# Altium project MotorControlPower.PrjPCB
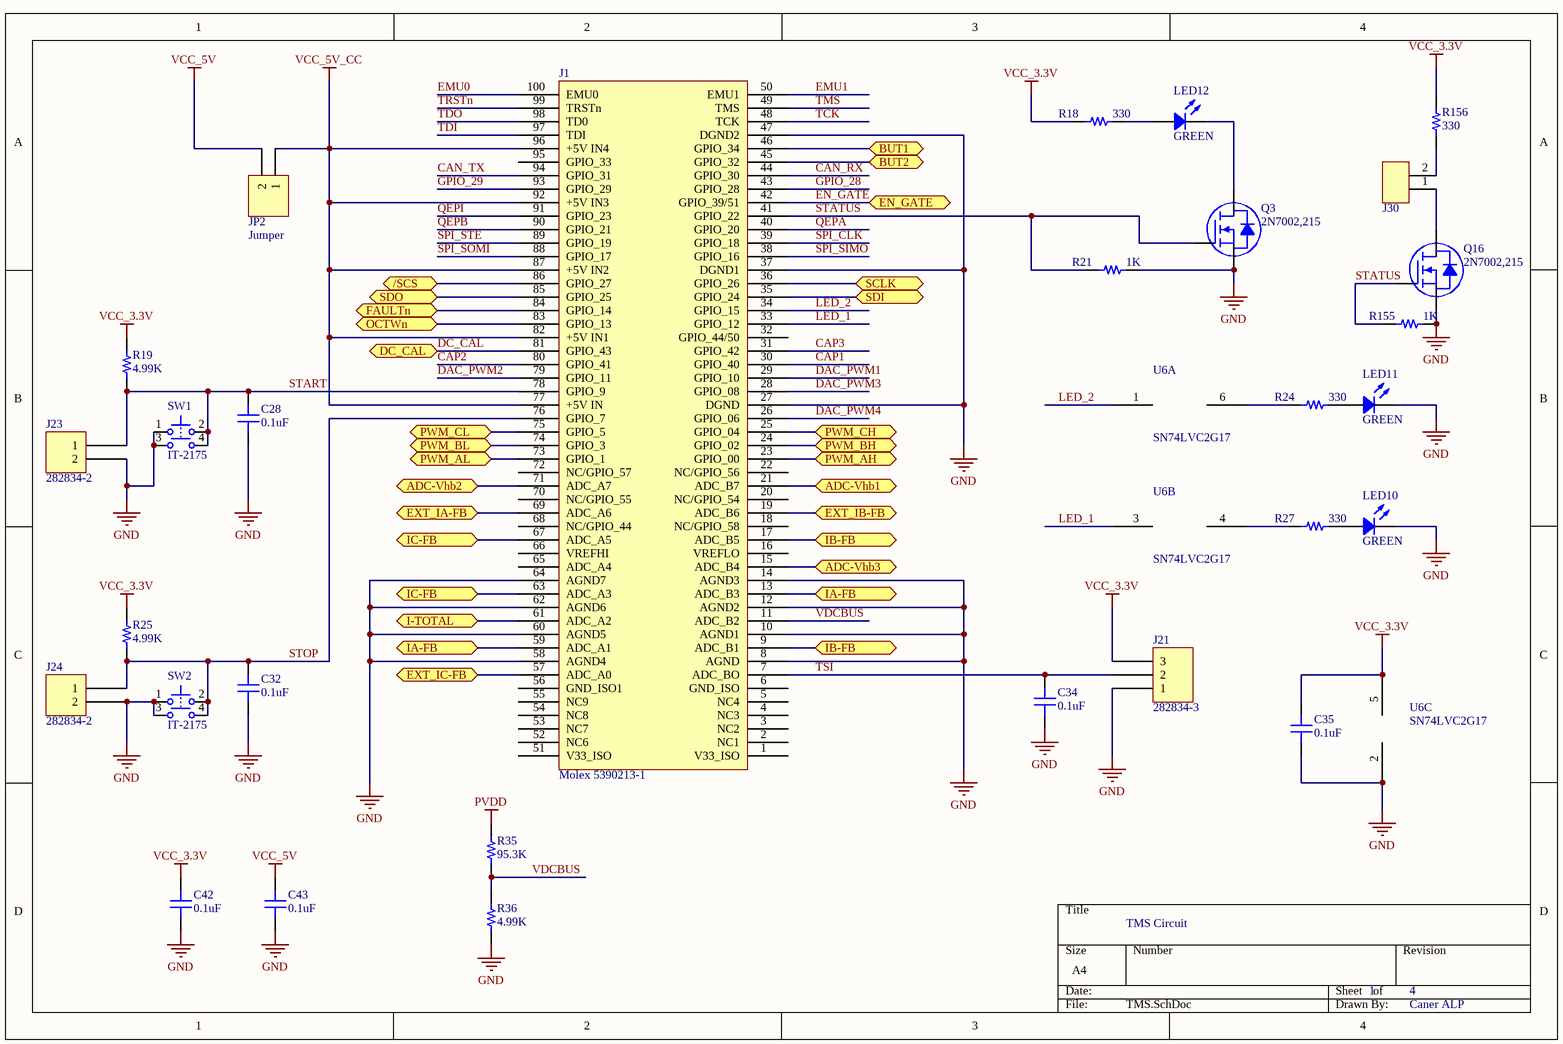
[diagram p0: TMS.SchDoc]
4 sheets, 225 parts. Net scope: flat (ports and power ports of the same name join across sheets).
Board file: Motor.PcbDoc
Sheets:
  TMS.SchDoc
  DRV8301.SchDoc
  Motor_Power.SchDoc
  Motor_PowerMosfet.SchDoc

## Sheet TMS.SchDoc: TMS Circuit
size A4; Date: 11.05.2017; DrawnBy: Caner ALP; Organization: Eastern Mediterranean University; DocumentNumber: 1; SheetNumber: 1; SheetTotal: 4; DocumentName: TMS Circuit; ProjectName: Tubitak Electric Vehicle Motor Control Board

### Parts
C28  0.1uF  [CAP 0603/1608]
C32  0.1uF  [CAP 0603/1608]
C34  0.1uF  [CAP 0603/1608]
C35  0.1uF  [CAP 0603/1608]
C42  0.1uF  [CAP 0603/1608]
C43  0.1uF  [CAP 0603/1608]
J1  Molex 5390213-1  [DIMM100]
J21  282834-3  [TE 282834-3]
J23  282834-2  [TE 282834-2]
J24  282834-2  [TE 282834-2]
J30  HDR_1x2  [PINHEAD_2.54mm_1x2]  (value not drawn)
JP2  Jumper  [Header 2.54mm - duplicate]
LED10  GREEN  [LED 0805/2012 YELLOW]
LED11  GREEN  [LED 0805/2012 YELLOW]
LED12  GREEN  [LED 0805/2012 YELLOW]
Q3  2N7002,215  [NXP SOT-23-3 TO-236AB]
Q16  2N7002,215  [NXP SOT-23-3 TO-236AB]
R18  330  [RES 0603/1608]
R19  4.99K  [RES 0603/1608]
R21  1K  [RES 0603/1608]
R24  330  [RES 0603/1608]
R25  4.99K  [RES 0603/1608]
R27  330  [RES 0603/1608]
R35  95.3K  [RES 0603/1608]
R36  4.99K  [RES 0603/1608]
R155  1K  [RES 0603/1608]
R156  330  [RES 0603/1608]
SW1  IT-2175  [Tick Tole Switch]
SW2  IT-2175  [Tick Tole Switch]
U6  SN74LVC2G17  [DBV006]  (parts A,B,C of 3)

### Ports
/SCS, ADC-Vhb1, ADC-Vhb2, ADC-Vhb3, BUT1, BUT2, DC_CAL, EN_GATE, EXT_IA-FB, EXT_IB-FB, EXT_IC-FB, FAULTn, I-TOTAL, IA-FB, IB-FB, IC-FB, OCTWn, PWM_AH, PWM_AL, PWM_BH, PWM_BL, PWM_CH, PWM_CL, SCLK, SDI, SDO

### Nets
GND: C28.1 C32.1 C34.1 C35.1 C42.1 C43.1 J1.8(AGND) J1.10(AGND1) J1.12(AGND2) J1.14(AGND3) J1.27(DGND) J1.37(DGND1) J1.47(DGND2) J1.58(AGND4) J1.60(AGND5) J1.62(AGND6) J1.64(AGND7) J21.1 J23.2 J24.2 LED10.2 LED11.2 Q3.3(S) Q16.3(S) R21.2 R36.2 R155.2 SW1.1 SW1.3 SW2.1 SW2.3 U6.2(EMU2)
PVDD: R35.1
VCC_3.3V: C35.2 C42.2 J21.3 R18.1 R19.2 R25.2 R156.2 U6.5(EMU1)
VCC_5V: C43.2 JP2.2
VCC_5V_CC: J1.77(+5V_IN) J1.82(+5V_IN1) J1.87(+5V_IN2) J1.92(+5V_IN3) J1.96(+5V_IN4) JP2.1
/SCS: J1.86(GPIO_27) ; port /SCS
CAN_RX: J1.44(GPIO_30)
CAN_TX: J1.94(GPIO_31)
CAP1: J1.30(GPIO_40)
CAP2: J1.80(GPIO_41)
CAP3: J1.31(GPIO_42)
DAC_PWM1: J1.29(GPIO_10)
DAC_PWM2: J1.79(GPIO_11)
DAC_PWM3: J1.28(GPIO_08)
DAC_PWM4: J1.26(GPIO_06)
DC_CAL: J1.81(GPIO_43) ; port DC_CAL
EMU0: J1.100(EMU0)
EMU1: J1.50(EMU1)
EN_GATE: J1.42(GPIO_39/51) ; port EN_GATE
FAULTn: J1.84(GPIO_14) ; port FAULTn
GPIO_28: J1.43(GPIO_28)
GPIO_29: J1.93(GPIO_29)
LED_1: J1.33(GPIO_12) U6.3(EMU1)
LED_2: J1.34(GPIO_15) U6.1(EMU1)
QEPA: J1.40(GPIO_20)
QEPB: J1.90(GPIO_21)
QEPI: J1.91(GPIO_23)
SCLK: J1.36(GPIO_26) ; port SCLK
SDI: J1.35(GPIO_24) ; port SDI
SDO: J1.85(GPIO_25) ; port SDO
SPI_CLK: J1.39(GPIO_18)
SPI_SIMO: J1.38(GPIO_16)
SPI_SOMI: J1.88(GPIO_17)
SPI_STE: J1.89(GPIO_19)
START: C28.2 J1.78(GPIO_9) J23.1 R19.1 SW1.2 SW1.4
STATUS: J1.41(GPIO_22) Q3.1(G) Q16.1(G) R21.1 R155.1
STOP: C32.2 J1.76(GPIO_7) J24.1 R25.1 SW2.2 SW2.4
TCK: J1.48(TCK)
TDI: J1.97(TDI)
TDO: J1.98(TD0)
TMS: J1.49(TMS)
TRSTn: J1.99(TRSTn)
TSI: C34.2 J1.7(ADC_BO) J21.2
VDCBUS: J1.11(ADC_B2) R35.2 R36.1
NetC67_2: J1.21(ADC_B7) ; port ADC-Vhb1
NetC68_2: J1.71(ADC_A7) ; port ADC-Vhb2
NetC69_2: J1.15(ADC_B4) ; port ADC-Vhb3
NetC86_2: J1.61(ADC_A2) ; port I-TOTAL
NetC87_2: J1.9(ADC_B1) J1.17(ADC_B5) ; port IB-FB
NetC88_2: J1.13(ADC_B3) J1.59(ADC_A1) ; port IA-FB
NetC95_2: J1.19(ADC_B6) ; port EXT_IB-FB
NetC96_2: J1.69(ADC_A6) ; port EXT_IA-FB
NetC97_2: J1.57(ADC_A0) ; port EXT_IC-FB
NetC150_2: J1.46(GPIO_34) ; port BUT1
NetC151_2: J1.45(GPIO_32) ; port BUT2
NetJ1_23: J1.23(GPIO_00) ; port PWM_AH
NetJ1_24: J1.24(GPIO_02) ; port PWM_BH
NetJ1_25: J1.25(GPIO_04) ; port PWM_CH
NetJ1_63: J1.63(ADC_A3) J1.67(ADC_A5) ; port IC-FB
NetJ1_73: J1.73(GPIO_1) ; port PWM_AL
NetJ1_74: J1.74(GPIO_3) ; port PWM_BL
NetJ1_75: J1.75(GPIO_5) ; port PWM_CL
NetJ1_83: J1.83(GPIO_13) ; port OCTWn
NetJ30_1: J30.1 Q16.2(D)
NetJ30_2: J30.2 R156.1
NetLED10_1: LED10.1 R27.2
NetLED11_1: LED11.1 R24.2
NetLED12_1: LED12.1 R18.2
NetLED12_2: LED12.2 Q3.2(D)
NetR24_1: R24.1 U6.6(EMU2)
NetR27_1: R27.1 U6.4(EMU2)

Not connected (* = marked no-connect by the designer): J1 1(V33_ISO) 2(NC1) 3(NC2) 4(NC3) 5(NC4) 6(GND_ISO) 16(VREFLO) 18(NC/GPIO_58) 20(NC/GPIO_54) 22(NC/GPIO_56) 32(GPIO_44/50) 51(V33_ISO) 52(NC6) 53(NC7) 54(NC8) 55(NC9) 56(GND_ISO1) 65(ADC_A4) 66(VREFHI) 68(NC/GPIO_44) 70(NC/GPIO_55) 72(NC/GPIO_57) 95(GPIO_33)

### Library data of the parts
C28 C32 C34 C35 C42 C43 = CC0603KPX7R7BB104: CAP CER 0.1UF 16V X7R 0603; Manufacturer: Yageo; TemperatureRange: -55C ~ 125C; Tolerance: 10%; Value: 0.1uF; Part Number: CC0603KPX7R7BB104; PartId: 5262; Supplier 1: Digi-Key; Supplier Part Number 1: 311-1335-2-ND; ComponentLink1Description: Datasheet; ComponentLink1URL: http://www.yageo.com/documents/recent/UPY-GPHC_X7R_6.3V-to-50V-v12.pdf; ComponentLink2Description: Digi-Key listing; ComponentLink2URL: http://digikey.com/product-detail/en/CC0603KPX7R7BB104/311-1335-2-ND/2103073; TemperatureCoefficient: X7R; Voltage: 16V; Price: 0,0043; Type: -; Device Package: 0603 (1608 Metric)
J1 = DIMM100 DRAM: DIMM Connectors DIMM SKT 100P 2.54mm
J21 = 282834-3: TERM BLOCK 3POS SIDE ENT 2.54MM; Manufacturer: TE Connectivity AMP Connectors; TemperatureRange: -40C ~ 105C; Voltage: 150V; Pitch: 0.100" (2.54mm); Number Of Levels: 1; Positions Per Level: 3; Part Number: 282834-3; PartId: 9290; Supplier 1: Digi-Key; Supplier Part Number 1: A98334-ND; ComponentLink1Description: Datasheet; ComponentLink1URL: http://www.te.com/commerce/DocumentDelivery/DDEController?Action=srchrtrv&DocNm=282834&DocType=Customer+Drawing&DocLang=English; ComponentLink2Description: Digi-Key Listing; ComponentLink2URL: http://www.digikey.ca/product-detail/en/282834-3/A98334-ND/1153264; Price: 2,25; Colour: Green; Orientation: Horizontal with Board
J23 J24 = 282834-2: TERM BLOCK 2POS SIDE ENT 2.54MM; Manufacturer: TE Connectivity AMP Connectors; TemperatureRange: -40C ~ 105C; Voltage: 150V; Pitch: 0.100" (2.54mm); Number Of Levels: 1; Positions Per Level: 2; Part Number: 282834-2; PartId: 9289; Supplier 1: Digi-Key; Supplier Part Number 1: A98333-ND; ComponentLink1Description: Datasheet; ComponentLink1URL: http://www.te.com/commerce/DocumentDelivery/DDEController?Action=srchrtrv&DocNm=282834&DocType=Customer+Drawing&DocLang=English; ComponentLink2Description: Digi-Key Listing; ComponentLink2URL: http://www.digikey.ca/product-detail/en/282834-2/A98333-ND/1150135; Price: 1,3; Colour: Green; Orientation: Horizontal with Board
J30 = J00093: CONN HEADER 2POS .100 VERT TIN; Part Number: J00093; Manufacturer: Molex, LLC; Manufacturer Part Number: 22284020; Connector Type: Header, Unshrouded, Breakaway; Pitch: 2.54mm; Number of Positions: 2; Current Rating: 4A; Voltage - Rated: 250V; Series: KK® 42375; Supplier 1: Digi-Key; Contact Type: Male Pin; Mounting Type: Through Hole; Supplier Part Number 1: WM50014-02-ND; HelpURL: http://www.molex.com/pdm_docs/sd/022284020_sd.pdf; Operating Temperature: -40°C ~ 105°C; Contact Finish: Tin; Housing Color: Black; Number of Rows: 1
JP2 = Header 2: Header, 2-Pin; LatestRevisionDate: 17-Jul-2002; LatestRevisionNote: Re-released for DXP Platform.; Publisher: Altium Limited
LED10-LED12 = LTST-C170KFKT: LED ORANGE CLEAR 0805 SMD; Manufacturer: Lite-On Inc.; Type: Surface Mount; Millicandela: 90mcd; Voltage Forward: 2V; Current (Test): 20mA; Viewing Angle: 130; Value: Green; Part Number: LTST-C170KFKT; PartId: 7079; Supplier 1: Digi-Key; Supplier Part Number 1: 160-1413-2-ND; ComponentLink1Description: Datasheet; ComponentLink1URL: http://optoelectronics.liteon.com/upload/download/DS-22-99-0185/S_110_LTST-C170KFKT.pdf; ComponentLink2Description: Digi-Key Listing; ComponentLink2URL: http://www.digikey.ca/product-detail/en/LTST-C170KFKT/160-1413-2-ND/386775; Price: 0,0638; Device Package: 0805 (2012 Metric); Colour: Orange; Lens Transparency: Clear
Q3 Q16 = 2N7002,215: MOSFET N-CH 60V 300MA SOT-23; Manufacturer: NXP Semiconductors; Type: MOSFET N-Channel, Metal Oxide; Rds On (Max) at Id, Vgs: 5 Ohm @ 500mA, 10V; Vgs(th) (Max) at Id: 2.5V @ 250uA; Input Capacitance (Ciss) at Vds: 50pF @ 10V; Power - Max: 830mW; Current Continuous Drain: 300mA (Ta); Part Number: 2N7002,215; PartId: 7965; Supplier 1: Digi-Key; Supplier Part Number 1: 568-1369-2-ND; ComponentLink1Description: Datasheet; ComponentLink1URL: http://www.nxp.com/documents/data_sheet/2N7002.pdf; ComponentLink2Description: Digi-Key Listing; ComponentLink2URL: http://www.digikey.com/product-detail/en/2N7002,215/568-1369-2-ND/762973; Price: 0,0368; Device Package: TO-236-3, SC-59, SOT-23-3; Gate Charge (Qg): -; Drain to Source Voltage (Vdss): 60V; Features: Logic Level Gate
R18 R24 R27 R156 = ERJ-3GEYJ331V: RES SMD 330 OHM 5% 1/10W 0603; Manufacturer: Panasonic Electronic Components; TemperatureRange: -55C ~ 155C; TemperatureCoefficient: 200ppm/C; PowerRating: 0.1W, 1/10W; Value: 330; Part Number: ERJ-3GEYJ331V; PartId: 11189; Supplier 1: Digi-Key; Supplier Part Number 1: P330GTR-ND; ComponentLink1Description: Datasheet; ComponentLink1URL: http://industrial.panasonic.com/www-cgi/jvcr13pz.cgi?E+PZ+3+AOA0001+ERJ3GEYJ331V+7+WW; ComponentLink2Description: Digi-Key Listing; ComponentLink2URL: https://www.digikey.com/product-detail/en/panasonic-electronic-components/ERJ-3GEYJ331V/P330GTR-ND/135755; Tolerance: 5%; Price: 0,002; Device Package: 0603 (1608 Metric)
R19 R21 R25 R35 R36 R155 = ERJ-3GEYJ331V: RES SMD 330 OHM 5% 1/10W 0603; Manufacturer: Panasonic Electronic Components; Value: 330; TemperatureRange: -55C ~ 155C; TemperatureCoefficient: 200ppm/C; PowerRating: 0.1W, 1/10W; Part Number: ERJ-3GEYJ331V; PartId: 11189; Supplier 1: Digi-Key; Supplier Part Number 1: P330GTR-ND; ComponentLink1Description: Datasheet; ComponentLink1URL: http://industrial.panasonic.com/www-cgi/jvcr13pz.cgi?E+PZ+3+AOA0001+ERJ3GEYJ331V+7+WW; ComponentLink2Description: Digi-Key Listing; ComponentLink2URL: https://www.digikey.com/product-detail/en/panasonic-electronic-components/ERJ-3GEYJ331V/P330GTR-ND/135755; Tolerance: 5%; Price: 0,002; Device Package: 0603 (1608 Metric)
SW1 SW2 = IT-2175: Tactile Switch, DPST; Thru-Hole; Vertical; Rating DC 12V, 50mA (max); PackageDocument: Rev.0; Published: 6-Jun-2005; DatasheetDocument: Rev.0; PackageReference: IT-2175; Publisher: Altium Limited; ComponentLink1Description: Manufacturer Link; ComponentLink1URL: http://www.ilswitch.com/; ComponentLink2Description: Device Overview; ComponentLink2URL: http://www.ilswitch.com/list.php?ac_id=010112&ai_id=91

## Sheet DRV8301.SchDoc: DRV8301
size A4; DrawnBy: Caner ALP; DocumentNumber: 2; SheetNumber: 2; SheetTotal: 4
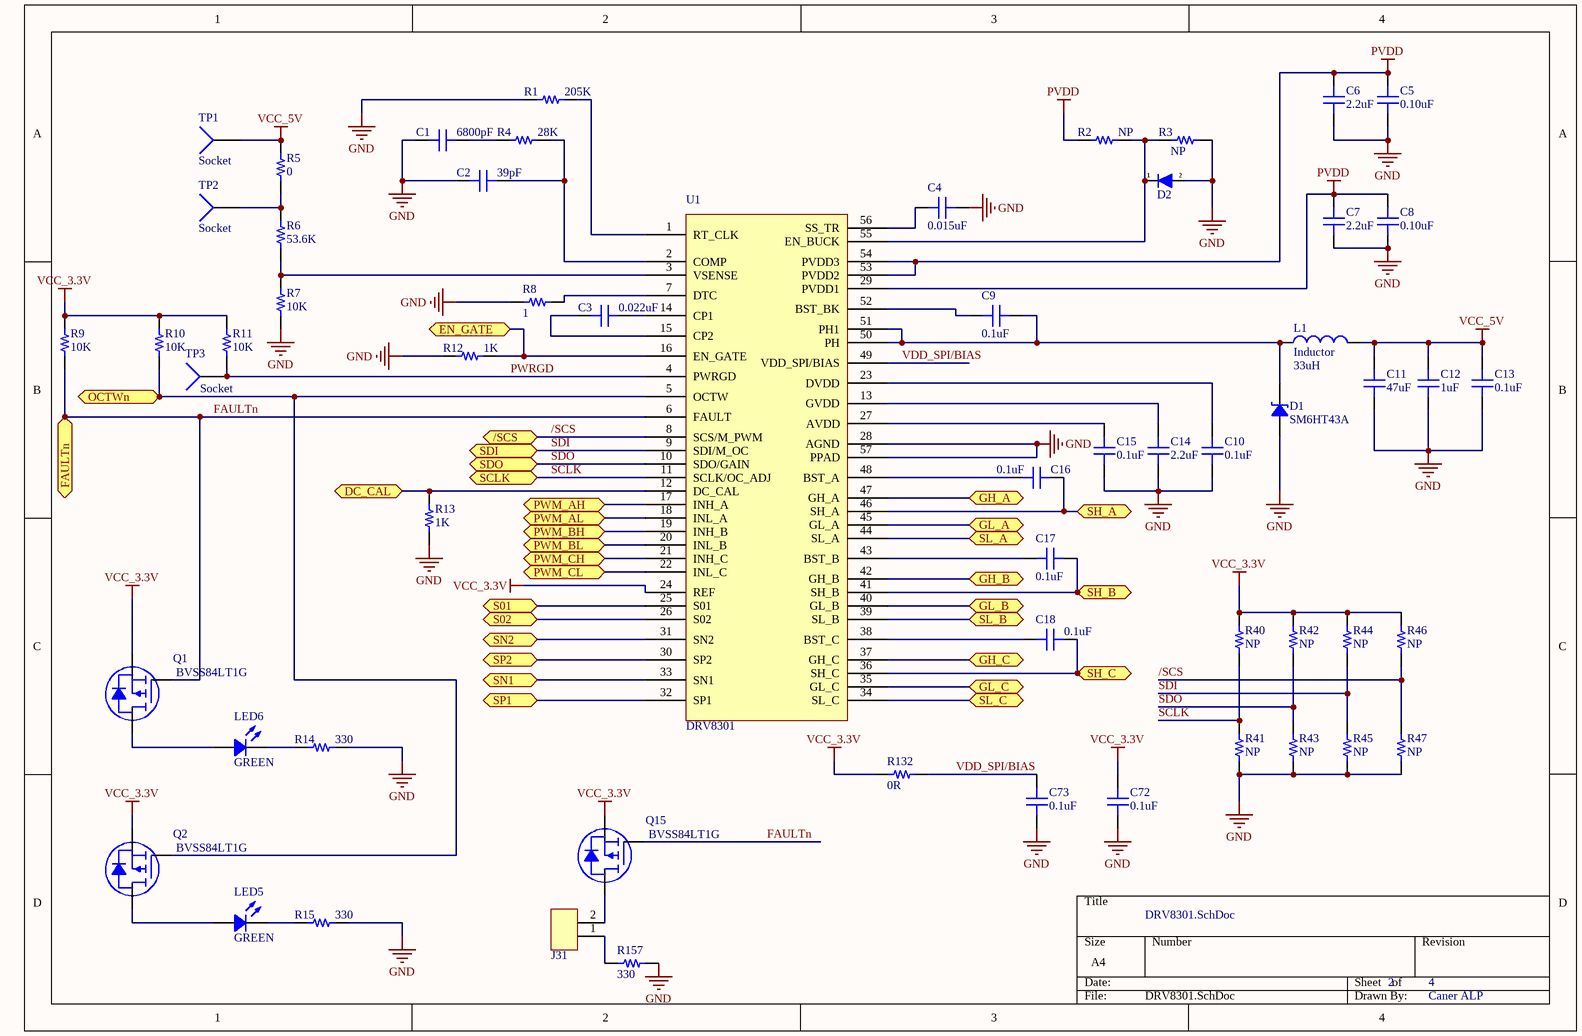
[diagram p1: DRV8301.SchDoc]

### Parts
C1  6800pF  [CAP 0603/1608]
C2  39pF  [CAP 0603/1608]
C3  0.022uF  [CAP 0603/1608]
C4  0.015uF  [CAP 0603/1608]
C5  0.10uF  [CAP 0805/2012]
C6  2.2uF  [CAP 1210/3225 - 2.5MM]
C7  2.2uF  [CAP 1210/3225 - 2.5MM]
C8  0.10uF  [CAP 0805/2012]
C9  0.1uF  [CAP 0603/1608]
C10  0.1uF  [CAP 0603/1608]
C11  47uF  [CAP 1210/3225 - 2.5MM]
C12  1uF  [CAP 0603/1608]
C13  0.1uF  [CAP 0603/1608]
C14  2.2uF  [CAP 0805/2012]
C15  0.1uF  [CAP 0603/1608]
C16  0.1uF  [CAP 0603/1608]
C17  0.1uF  [CAP 0603/1608]
C18  0.1uF  [CAP 0603/1608]
C72  0.1uF  [CAP 0603/1608]
C73  0.1uF  [CAP 0603/1608]
D1  SM6HT43A  [ST DO214AA SMB]
D2  1N5819  [SOD-123]  (value not drawn)
J31  HDR_1x2  [PINHEAD_2.54mm_1x2]  (value not drawn)
L1  Inductor  value 33uH  [9x9mm SMD Coil]
LED5  GREEN  [LED 0805/2012 YELLOW]
LED6  GREEN  [LED 0805/2012 YELLOW]
Q1  BVSS84LT1G  [ON SEMI SOT-23-3]
Q2  BVSS84LT1G  [ON SEMI SOT-23-3]
Q15  BVSS84LT1G  [ON SEMI SOT-23-3]
R1  205K  [RES 0603/1608]
R2  NP  [RES 0603/1608]
R3  NP  [RES 0603/1608]
R4  28K  [RES 0603/1608]
R5  0  [RES 0603/1608]
R6  53.6K  [RES 0603/1608]
R7  10K  [RES 0603/1608]
R8  1  [RES 0603/1608]
R9  10K  [RES 0603/1608]
R10  10K  [RES 0603/1608]
R11  10K  [RES 0603/1608]
R12  1K  [RES 0603/1608]
R13  1K  [RES 0603/1608]
R14  330  [RES 0603/1608]
R15  330  [RES 0603/1608]
R40  NP  [RES 0603/1608]
R41  NP  [RES 0603/1608]
R42  NP  [RES 0603/1608]
R43  NP  [RES 0603/1608]
R44  NP  [RES 0603/1608]
R45  NP  [RES 0603/1608]
R46  NP  [RES 0603/1608]
R47  NP  [RES 0603/1608]
R132  0R  [RES 0603/1608]
R157  330  [RES 0603/1608]
TP1  Socket  [PIN1]
TP2  Socket  [PIN1]
TP3  Socket  [PIN1]
U1  DRV8301  [HTSSOP56]

### Ports
/SCS, DC_CAL, EN_GATE, FAULTn, GH_A, GH_B, GH_C, GL_A, GL_B, GL_C, OCTWn, PWM_AH, PWM_AL, PWM_BH, PWM_BL, PWM_CH, PWM_CL, S01, S02, SCLK, SDI, SDO, SH_A, SH_B, SH_C, SL_A, SL_B, SL_C, SN1, SN2, SP1, SP2

### Nets
GND: C1.2 C2.2 C4.2 C5.1 C6.1 C7.1 C8.1 C10.1 C11.1 C12.1 C13.1 C14.1 C15.1 C72.1 C73.1 D1.1 D2.2 R1.2 R3.1 R7.1 R8.2 R12.1 R13.1 R14.2 R15.2 R41.2 R43.2 R45.2 R47.2 R157.1 U1.28(AGND) U1.57(PPAD)
PVDD: C5.2 C6.2 C7.2 C8.2 R2.2 U1.29(PVDD1) U1.53(PVDD2) U1.54(PVDD3)
VCC_3.3V: C72.2 Q1.3(S) Q2.3(S) Q15.3(S) R9.1 R10.1 R11.1 R40.1 R42.1 R44.1 R46.1 R132.1 U1.24(REF)
VCC_5V: C11.2 C12.2 C13.2 L1.2 R5.2 TP1.1
/SCS: R46.2 R47.1 U1.8(SCS/M_PWM) ; port /SCS
DC_CAL: R13.2 U1.12(DC_CAL) ; port DC_CAL
EN_GATE: R12.2 U1.16(EN_GATE) ; port EN_GATE
FAULTn: Q1.1(G) Q15.1(G) R9.2 U1.6(FAULT) ; port FAULTn
PWRGD: R11.2 TP3.1 U1.4(PWRGD)
SCLK: R40.2 R41.1 U1.11(SCLK/OC_ADJ) ; port SCLK
SDI: R44.2 R45.1 U1.9(SDI/M_OC) ; port SDI
SDO: R42.2 R43.1 U1.10(SDO/GAIN) ; port SDO
VDD_SPI/BIAS: C73.2 R132.2 U1.49(VDD_SPI/BIAS)
NetC1_1: C1.1 R4.2
NetC2_1: C2.1 R4.1 U1.2(COMP)
NetC3_1: C3.1 U1.14(CP1)
NetC3_2: C3.2 U1.15(CP2)
NetC4_1: C4.1 U1.56(SS_TR)
NetC9_1: C9.1 U1.52(BST_BK)
NetC9_2: C9.2 D1.2 L1.1 U1.50(PH) U1.51(PH1)
NetC10_2: C10.2 U1.23(DVDD)
NetC14_2: C14.2 U1.13(GVDD)
NetC15_2: C15.2 U1.27(AVDD)
NetC16_1: C16.1 U1.46(SH_A) ; port SH_A
NetC16_2: C16.2 U1.48(BST_A)
NetC17_1: C17.1 U1.41(SH_B) ; port SH_B
NetC17_2: C17.2 U1.43(BST_B)
NetC18_1: C18.1 U1.36(SH_C) ; port SH_C
NetC18_2: C18.2 U1.38(BST_C)
NetC79_1: U1.32(SP1) ; port SP1
NetC79_2: U1.33(SN1) ; port SN1
NetC80_1: U1.30(SP2) ; port SP2
NetC80_2: U1.31(SN2) ; port SN2
NetC87_2: U1.26(S02) ; port S02
NetC88_2: U1.25(S01) ; port S01
NetD2_1: D2.1 R2.1 R3.2 U1.55(EN_BUCK)
NetJ1_23: U1.17(INH_A) ; port PWM_AH
NetJ1_24: U1.19(INH_B) ; port PWM_BH
NetJ1_25: U1.21(INH_C) ; port PWM_CH
NetJ1_73: U1.18(INL_A) ; port PWM_AL
NetJ1_74: U1.20(INL_B) ; port PWM_BL
NetJ1_75: U1.22(INL_C) ; port PWM_CL
NetJ1_83: Q2.1(G) R10.2 U1.5(OCTW) ; port OCTWn
NetJ31_1: J31.1 R157.2
NetJ31_2: J31.2 Q15.2(D)
NetLED5_1: LED5.1 Q2.2(D)
NetLED5_2: LED5.2 R15.1
NetLED6_1: LED6.1 Q1.2(D)
NetLED6_2: LED6.2 R14.1
NetQ7_3: U1.44(SL_A) ; port SL_A
NetQ8_3: U1.34(SL_C) ; port SL_C
NetQ9_3: U1.39(SL_B) ; port SL_B
NetR1_1: R1.1 U1.1(RT_CLK)
NetR5_1: R5.1 R6.2 TP2.1
NetR6_1: R6.1 R7.2 U1.3(VSENSE)
NetR8_1: R8.1 U1.7(DTC)
NetR66_2: U1.47(GH_A) ; port GH_A
NetR67_2: U1.37(GH_C) ; port GH_C
NetR68_2: U1.42(GH_B) ; port GH_B
NetR69_2: U1.45(GL_A) ; port GL_A
NetR70_2: U1.35(GL_C) ; port GL_C
NetR71_2: U1.40(GL_B) ; port GL_B

### Library data of the parts
C1-C4 C9 C10 C12 C13 C15-C18 C72 C73 = CC0603KPX7R7BB104: as C28 on sheet TMS; Value: 0.1uF; Part Number: CC0603KPX7R7BB104; PartId: 5262; Supplier 1: Digi-Key; Supplier Part Number 1: 311-1335-2-ND; ComponentLink1Description: Datasheet; ComponentLink1URL: http://www.yageo.com/documents/recent/UPY-GPHC_X7R_6.3V-to-50V-v12.pdf; ComponentLink2Description: Digi-Key listing; ComponentLink2URL: http://digikey.com/product-detail/en/CC0603KPX7R7BB104/311-1335-2-ND/2103073; TemperatureCoefficient: X7R; Voltage: 16V; Price: 0,0043; Type: -; Device Package: 0603 (1608 Metric)
C5 C8 = C0805C104K1RACTU: CAP CER 0.1UF 100V X7R 0805; Manufacturer: Kemet; TemperatureRange: -55C ~ 125C; Tolerance: 10%; Value: 0.10uF; Part Number: C0805C104K1RACTU; PartId: 13746; Supplier 1: Digi-Key; Supplier Part Number 1: 399-3486-2-ND; ComponentLink1Description: Datasheet; ComponentLink1URL: http://www.kemet.com/docfinder?Partnumber=C0805C104K1RACTU; ComponentLink2Description: Digi-Key Listing; ComponentLink2URL: https://www.digikey.com/product-detail/en/kemet/C0805C104K1RACTU/399-3486-2-ND/754748; TemperatureCoefficient: X7R; Voltage: 100V; Price: 0,0462; Device Package: 0805 (2012 Metric)
C6 C7 C11 = C3225X7R2A225K230AM: CAP CER 2.2UF 100V X7R 1210; Manufacturer: TDK Corporation; TemperatureRange: -55C ~ 125C; Tolerance: 10%; Value: 2.2uF; Part Number: C3225X7R2A225K230AM; PartId: 18956; Supplier 1: Digi-Key; Supplier Part Number 1: 445-6098-2-ND; ComponentLink1Description: Datasheet; ComponentLink1URL: https://product.tdk.com/info/en/catalog/datasheets/mlcc_commercial_openmode_en.pdf; ComponentLink2Description: Digi-Key Listing; ComponentLink2URL: https://www.digikey.com/product-detail/en/tdk-corporation/C3225X7R2A225K230AM/445-6098-2-ND/2443575; TemperatureCoefficient: X7R; Voltage: 100V; Price: 0,3129; Device Package: 1210 (3225 Metric)
C14 = C0805C104K1RACTU: CAP CER 0.1UF 100V X7R 0805; Manufacturer: Kemet; Value: 0.10uF; TemperatureRange: -55C ~ 125C; Tolerance: 10%; Part Number: C0805C104K1RACTU; PartId: 13746; Supplier 1: Digi-Key; Supplier Part Number 1: 399-3486-2-ND; ComponentLink1Description: Datasheet; ComponentLink1URL: http://www.kemet.com/docfinder?Partnumber=C0805C104K1RACTU; ComponentLink2Description: Digi-Key Listing; ComponentLink2URL: https://www.digikey.com/product-detail/en/kemet/C0805C104K1RACTU/399-3486-2-ND/754748; TemperatureCoefficient: X7R; Voltage: 100V; Price: 0,0462; Device Package: 0805 (2012 Metric)
D1 = SM6HT43A: TVS DIODE 36.8VWM 59.3VC SMB; Manufacturer: STMicroelectronics; Type: Zener; Unidirectional Channels: 1; Power - Peak Pulse: 600W; Current - Peak Pulse: 10.1A; Voltage (Clamping): 59.3V; Voltage (Breakdown): 40.9V; Voltage (Reverse Standoff): 36.8V; Part Number: SM6HT43A; PartId: 14657; Supplier 1: Digi-Key; Supplier Part Number 1: 497-7425-2-ND; ComponentLink1Description: Datasheet; ComponentLink1URL: http://www.st.com/web/en/resource/technical/document/datasheet/CD00001782.pdf; ComponentLink2Description: Digi-Key Listing; ComponentLink2URL: https://www.digikey.com/product-detail/en/stmicroelectronics/SM6HT43A/497-7425-2-ND/1039067; Operating Temperature: -65C ~ 175C (TJ); Price: 0,2755; Device Package: DO-214AA, SMB
D2 = DIO00002: DIODE SCHOTTKY 40V 1A SOD123; Manufacturer Part Number: 1N5819HW-7-F; Manufacturer: Diodes Incorporated; Check Footprint: AB; Part Number: DIO00002; Check Symbol: AB; HelpURL: http://www.diodes.com/_files/datasheets/ds30217.pdf; Supplier 1: Digi-Key; Supplier Part Number 1: 1N5819HW-FDICT-ND; Voltage - DC Reverse (Max): 40V; Current: 1A; Reverse Recovery Time (trr): -; Type: Schottky; Operating Temperature: -65°C ~ 125°C
J31 = J00093: as J30 on sheet TMS; Series: KK® 42375; Supplier 1: Digi-Key; Contact Type: Male Pin; Mounting Type: Through Hole; Supplier Part Number 1: WM50014-02-ND; HelpURL: http://www.molex.com/pdm_docs/sd/022284020_sd.pdf; Operating Temperature: -40°C ~ 105°C; Contact Finish: Tin; Housing Color: Black; Number of Rows: 1
L1 = Inductor: Code_IEC: 1005; Published: 8-Jun-2000; LatestRevisionDate: 29-May-2009; LatestRevisionNote: IPC-7351 Footprint Added.; PackageReference: 0402-A; Publisher: Altium Limited; PackageDescription: Chip Inductor; Code_JEITA: 0402
LED5 LED6 = LTST-C170KFKT: as LED10 on sheet TMS; Value: Green; Part Number: LTST-C170KFKT; PartId: 7079; Supplier 1: Digi-Key; Supplier Part Number 1: 160-1413-2-ND; ComponentLink1Description: Datasheet; ComponentLink1URL: http://optoelectronics.liteon.com/upload/download/DS-22-99-0185/S_110_LTST-C170KFKT.pdf; ComponentLink2Description: Digi-Key Listing; ComponentLink2URL: http://www.digikey.ca/product-detail/en/LTST-C170KFKT/160-1413-2-ND/386775; Price: 0,0638; Device Package: 0805 (2012 Metric); Colour: Orange; Lens Transparency: Clear
Q1 Q2 Q15 = BVSS84LT1G: MOSFET P-CH 50V 130MA SOT-23-3; Manufacturer: ON Semiconductor; Type: MOSFET P-Channel, Metal Oxide; Rds On (Max) at Id, Vgs: 10 Ohm @ 100mA, 5V; Vgs(th) (Max) at Id: 2V @ 250uA; Gate Charge (Qg): 2.2nC @ 10V; Input Capacitance (Ciss) at Vds: 36pF @ 5V; Power - Max: 225mW; Current Continuous Drain: 130mA (Ta); Part Number: BVSS84LT1G; PartId: 8198; Supplier 1: Digi-Key; Supplier Part Number 1: BVSS84LT1GOSTR-ND; ComponentLink1Description: Datasheet; ComponentLink1URL: http://www.onsemi.com/pub_link/Collateral/BSS84LT1-D.PDF; ComponentLink2Description: Digi-Key Listing; ComponentLink2URL: http://www.digikey.com/product-detail/en/BVSS84LT1G/BVSS84LT1GOSTR-ND/3062044; Price: 0,0674; Device Package: TO-236-3, SC-59, SOT-23-3; Drain to Source Voltage (Vdss): 50V; Features: Standard
R1-R13 R40-R47 R132 = ERJ-3GEYJ331V: as R19 on sheet TMS; Part Number: ERJ-3GEYJ331V; PartId: 11189; Supplier 1: Digi-Key; Supplier Part Number 1: P330GTR-ND; ComponentLink1Description: Datasheet; ComponentLink1URL: http://industrial.panasonic.com/www-cgi/jvcr13pz.cgi?E+PZ+3+AOA0001+ERJ3GEYJ331V+7+WW; ComponentLink2Description: Digi-Key Listing; ComponentLink2URL: https://www.digikey.com/product-detail/en/panasonic-electronic-components/ERJ-3GEYJ331V/P330GTR-ND/135755; Tolerance: 5%; Price: 0,002; Device Package: 0603 (1608 Metric)
R14 R15 R157 = ERJ-3GEYJ331V: as R18 on sheet TMS; Value: 330; Part Number: ERJ-3GEYJ331V; PartId: 11189; Supplier 1: Digi-Key; Supplier Part Number 1: P330GTR-ND; ComponentLink1Description: Datasheet; ComponentLink1URL: http://industrial.panasonic.com/www-cgi/jvcr13pz.cgi?E+PZ+3+AOA0001+ERJ3GEYJ331V+7+WW; ComponentLink2Description: Digi-Key Listing; ComponentLink2URL: https://www.digikey.com/product-detail/en/panasonic-electronic-components/ERJ-3GEYJ331V/P330GTR-ND/135755; Tolerance: 5%; Price: 0,002; Device Package: 0603 (1608 Metric)
U1 = DRV83xx
TP1-TP3 = Socket: LatestRevisionDate: 17-Jul-2002; LatestRevisionNote: Re-released for DXP Platform.; Publisher: Altium Limited

## Sheet Motor_Power.SchDoc
size A3; DrawnBy: Caner ALP; DocumentNumber: 3; SheetNumber: 3; SheetTotal: 4
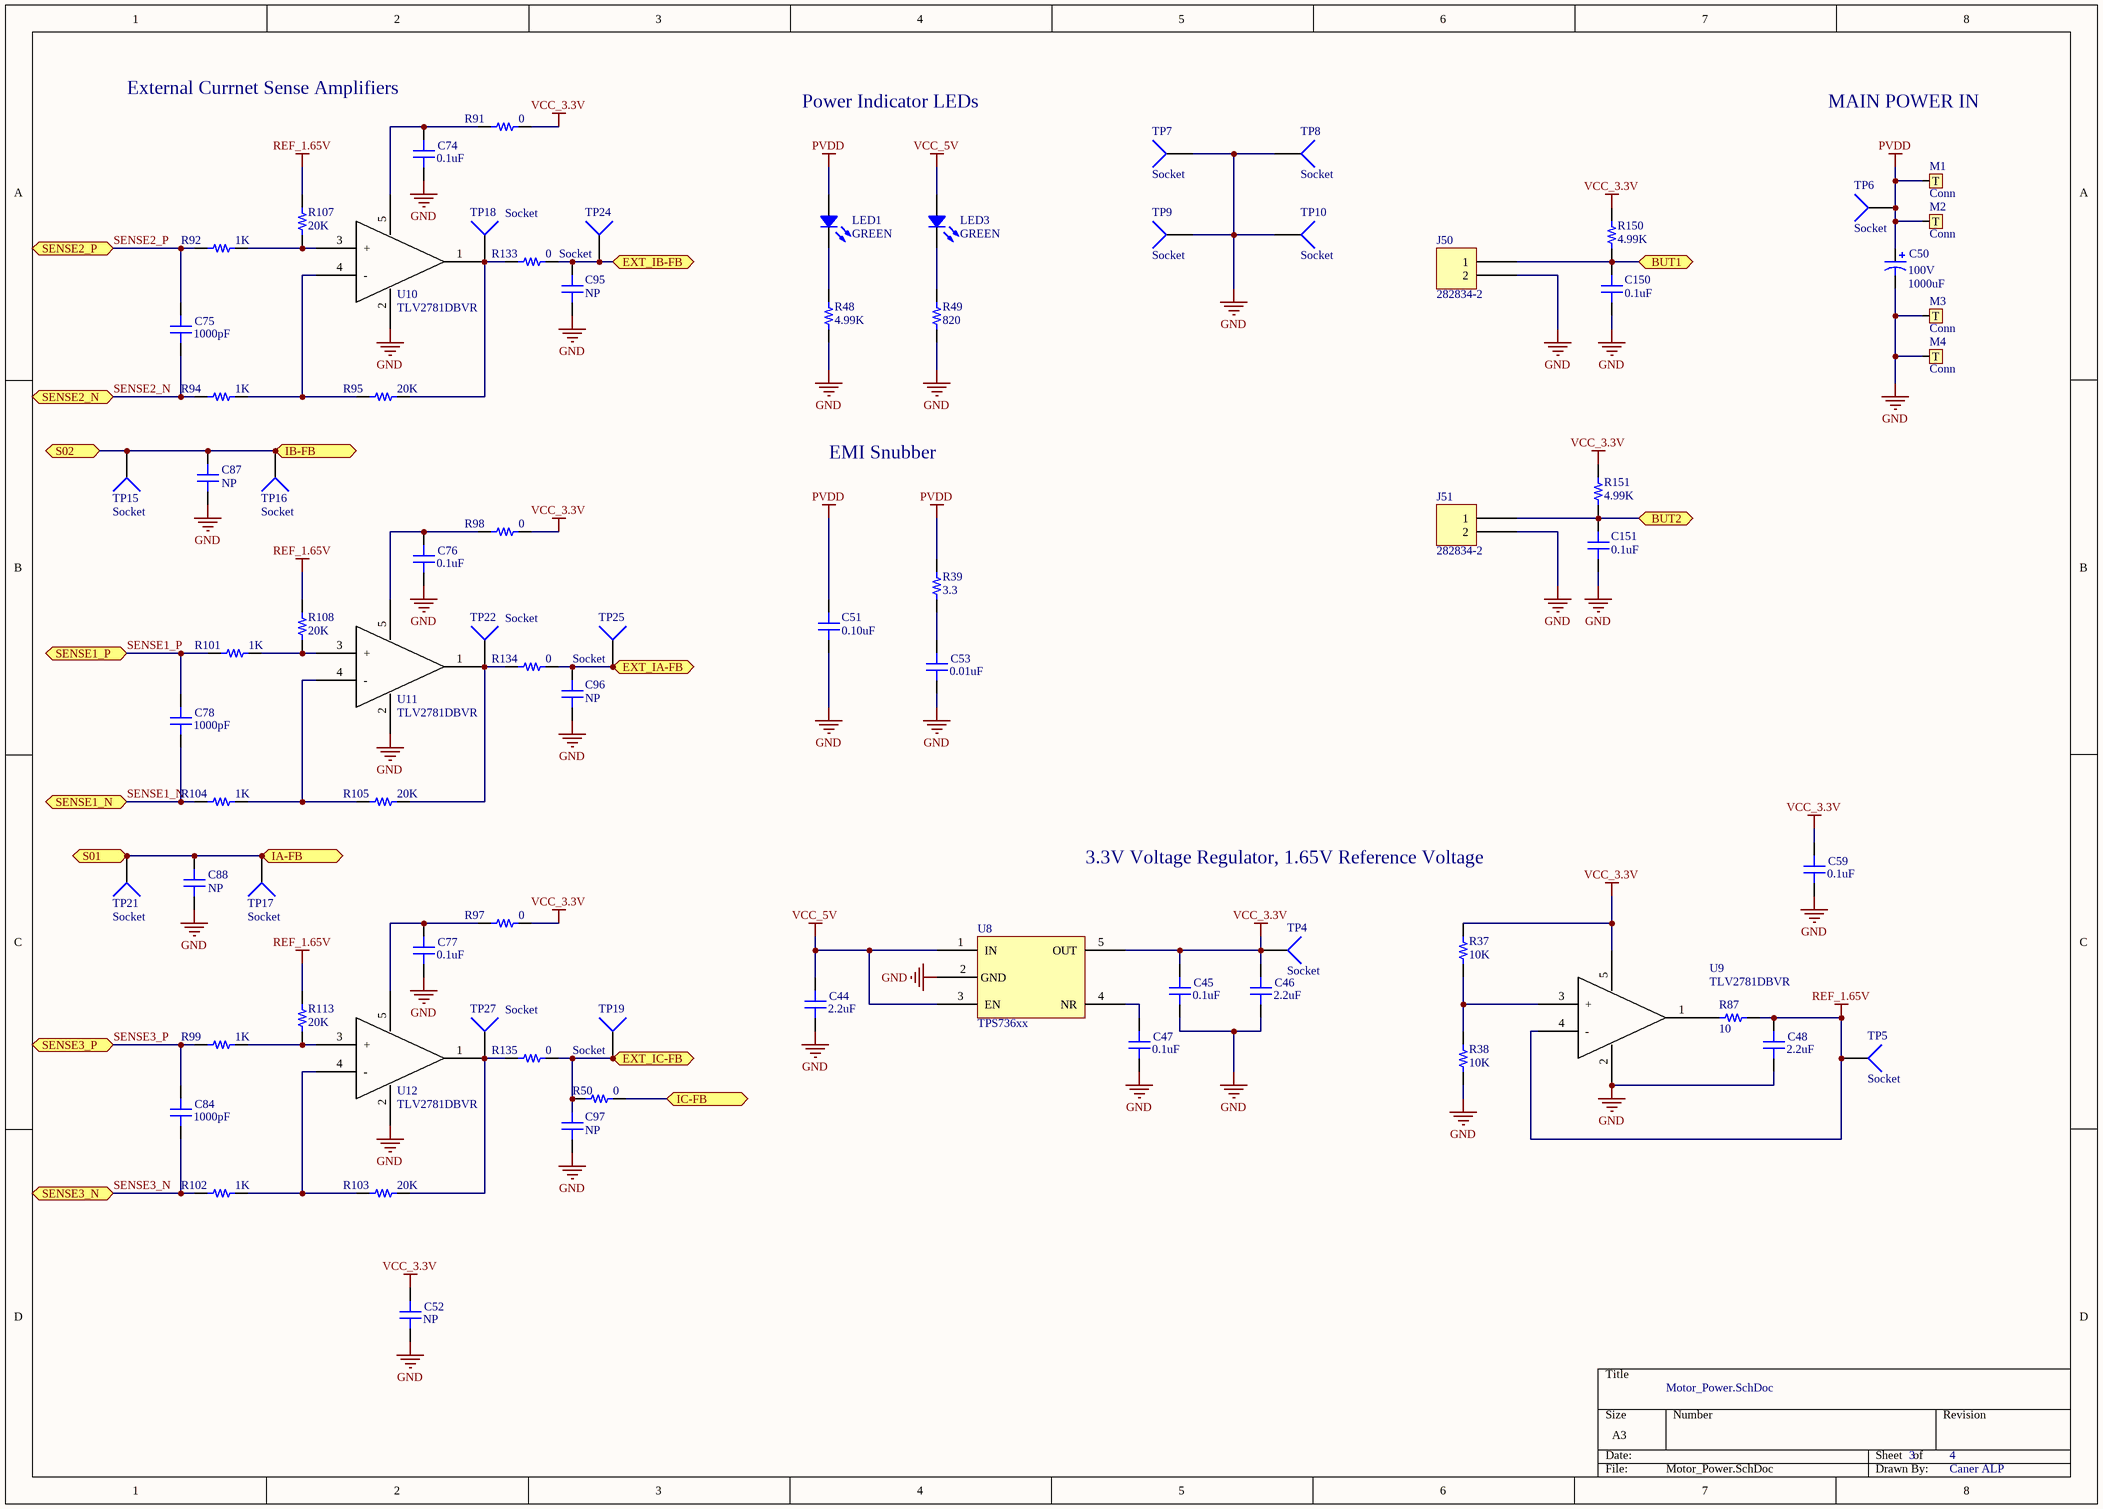
[diagram p2: Motor_Power.SchDoc]

### Parts
C44  2.2uF  [CAP 0603/1608]
C45  0.1uF  [CAP 0603/1608]
C46  2.2uF  [CAP 0603/1608]
C47  0.1uF  [CAP 0603/1608]
C48  2.2uF  [CAP 0603/1608]
C50  100V  value 1000uF  [CAPPR7.5-18x35.5]
C51  0.10uF  [CAP 0805/2012]
C52  NP  [CAP 0603/1608]
C53  0.01uF  [CAP 0603/1608]
C59  0.1uF  [CAP 0603/1608]
C74  0.1uF  [CAP 0603/1608]
C75  1000pF  [CAP 0603/1608]
C76  0.1uF  [CAP 0603/1608]
C77  0.1uF  [CAP 0603/1608]
C78  1000pF  [CAP 0603/1608]
C84  1000pF  [CAP 0603/1608]
C87  NP  [CAP 0603/1608]
C88  NP  [CAP 0603/1608]
C95  NP  [CAP 0603/1608]
C96  NP  [CAP 0603/1608]
C97  NP  [CAP 0603/1608]
C150  0.1uF  [CAP 0603/1608]
C151  0.1uF  [CAP 0603/1608]
J50  282834-2  [TE 282834-2]
J51  282834-2  [TE 282834-2]
LED1  GREEN  [LED 0805/2012 YELLOW]
LED3  GREEN  [LED 0805/2012 YELLOW]
M1  Conn  [M5 Nut]
M2  Conn  [M5 Nut]
M3  Conn  [M5 Nut]
M4  Conn  [M5 Nut]
R37  10K  [RES 0603/1608]
R38  10K  [RES 0603/1608]
R39  3.3  [RES 1206/3216]
R48  4.99K  [RES 0603/1608]
R49  820  [RES 0603/1608]
R50  0  [RES 0603/1608]
R87  10  [RES 0603/1608]
R91  0  [RES 0603/1608]
R92  1K  [RES 0603/1608]
R94  1K  [RES 0603/1608]
R95  20K  [RES 0603/1608]
R97  0  [RES 0603/1608]
R98  0  [RES 0603/1608]
R99  1K  [RES 0603/1608]
R101  1K  [RES 0603/1608]
R102  1K  [RES 0603/1608]
R103  20K  [RES 0603/1608]
R104  1K  [RES 0603/1608]
R105  20K  [RES 0603/1608]
R107  20K  [RES 0603/1608]
R108  20K  [RES 0603/1608]
R113  20K  [RES 0603/1608]
R133  0  [RES 0603/1608]
R134  0  [RES 0603/1608]
R135  0  [RES 0603/1608]
R150  4.99K  [RES 0603/1608]
R151  4.99K  [RES 0603/1608]
TP4  Socket  [PIN1]
TP5  Socket  [PIN1]
TP6  Socket  [PIN1]
TP7  Socket  [PIN1]
TP8  Socket  [PIN1]
TP9  Socket  [PIN1]
TP10  Socket  [PIN1]
TP15  Socket  [PIN1]
TP16  Socket  [PIN1]
TP17  Socket  [PIN1]
TP18  Socket  [PIN1]
TP19  Socket  [PIN1]
TP21  Socket  [PIN1]
TP22  Socket  [PIN1]
TP24  Socket  [PIN1]
TP25  Socket  [PIN1]
TP27  Socket  [PIN1]
U8  TPS736xx  [DBV005]
U9  TLV2781DBVR  [DBV005]
U10  TLV2781DBVR  [DBV005]
U11  TLV2781DBVR  [DBV005]
U12  TLV2781DBVR  [DBV005]

### Ports
BUT1, BUT2, EXT_IA-FB, EXT_IB-FB, EXT_IC-FB, IA-FB, IB-FB, IC-FB, S01, S02, SENSE1_N, SENSE1_P, SENSE2_N, SENSE2_P, SENSE3_N, SENSE3_P

### Nets
GND: C44.1 C45.1 C46.1 C47.1 C48.1 C50.2 C51.1 C52.1 C53.1 C59.1 C74.1 C76.1 C77.1 C87.1 C88.1 C95.1 C96.1 C97.1 C150.1 C151.1 J50.2 J51.2 M3.1(T) M4.1(T) R38.2 R48.1 R49.1 TP7.1 TP8.1 TP9.1 TP10.1 U8.2(GND) U9.2 U10.2 U11.2 U12.2
PVDD: C50.1 C51.2 LED1.1 M1.1(T) M2.1(T) R39.2 TP6.1
REF_1.65V: C48.2 R87.2 R107.1 R108.1 R113.1 TP5.1 U9.4(-)
VCC_3.3V: C45.2 C46.2 C52.2 C59.2 R37.1 R91.1 R97.1 R98.1 R150.2 R151.2 TP4.1 U8.5(OUT) U9.5
VCC_5V: C44.2 LED3.1 U8.1(IN) U8.3(EN)
SENSE1_N: C78.1 R104.2 ; port SENSE1_N
SENSE1_P: C78.2 R101.2 ; port SENSE1_P
SENSE2_N: C75.1 R94.2 ; port SENSE2_N
SENSE2_P: C75.2 R92.2 ; port SENSE2_P
SENSE3_N: C84.1 R102.2 ; port SENSE3_N
SENSE3_P: C84.2 R99.2 ; port SENSE3_P
NetC47_2: C47.2 U8.4(NR)
NetC53_2: C53.2 R39.1
NetC74_2: C74.2 R91.2 U10.5
NetC76_2: C76.2 R98.2 U11.5
NetC77_2: C77.2 R97.2 U12.5
NetC87_2: C87.2 TP15.1 TP16.1 ; port IB-FB, port S02
NetC88_2: C88.2 TP17.1 TP21.1 ; port IA-FB, port S01
NetC95_2: C95.2 R133.1 TP24.1 ; port EXT_IB-FB
NetC96_2: C96.2 R134.1 TP25.1 ; port EXT_IA-FB
NetC97_2: C97.2 R50.2 R135.1 TP19.1 ; port EXT_IC-FB
NetC150_2: C150.2 J50.1 R150.1 ; port BUT1
NetC151_2: C151.2 J51.1 R151.1 ; port BUT2
NetJ1_63: R50.1 ; port IC-FB
NetLED1_2: LED1.2 R48.2
NetLED3_2: LED3.2 R49.2
NetR37_2: R37.2 R38.1 U9.3(+)
NetR87_1: R87.1 U9.1
NetR92_1: R92.1 R107.2 U10.3(+)
NetR94_1: R94.1 R95.2 U10.4(-)
NetR95_1: R95.1 R133.2 TP18.1 U10.1
NetR99_1: R99.1 R113.2 U12.3(+)
NetR101_1: R101.1 R108.2 U11.3(+)
NetR102_1: R102.1 R103.2 U12.4(-)
NetR103_1: R103.1 R135.2 TP27.1 U12.1
NetR104_1: R104.1 R105.2 U11.4(-)
NetR105_1: R105.1 R134.2 TP22.1 U11.1

### Notes on the sheet
- External Currnet Sense Amplifiers
- Power Indicator LEDs
- MAIN POWER IN
- EMI Snubber
- 3.3V Voltage Regulator, 1.65V Reference Voltage

### Library data of the parts
C44-C48 C52 C53 C59 C74-C78 C84 C87 C88 C95-C97 C150 C151 = CC0603KPX7R7BB104: as C28 on sheet TMS; Value: 0.1uF; Part Number: CC0603KPX7R7BB104; PartId: 5262; Supplier 1: Digi-Key; Supplier Part Number 1: 311-1335-2-ND; ComponentLink1Description: Datasheet; ComponentLink1URL: http://www.yageo.com/documents/recent/UPY-GPHC_X7R_6.3V-to-50V-v12.pdf; ComponentLink2Description: Digi-Key listing; ComponentLink2URL: http://digikey.com/product-detail/en/CC0603KPX7R7BB104/311-1335-2-ND/2103073; TemperatureCoefficient: X7R; Voltage: 16V; Price: 0,0043; Type: -; Device Package: 0603 (1608 Metric)
C50 = Cap Pol1: Polarized Capacitor (Radial); Published: 8-Jun-2000; LatestRevisionDate: 17-Jul-2002; LatestRevisionNote: Re-released for DXP Platform.; PackageReference: RB7.6-15; Publisher: Altium Limited; PackageDescription: Polarized Capacitor (Radial); 2 Leads
C51 = C0805C104K1RACTU: as C5 on sheet DRV8301; Value: 0.10uF; Part Number: C0805C104K1RACTU; PartId: 13746; Supplier 1: Digi-Key; Supplier Part Number 1: 399-3486-2-ND; ComponentLink1Description: Datasheet; ComponentLink1URL: http://www.kemet.com/docfinder?Partnumber=C0805C104K1RACTU; ComponentLink2Description: Digi-Key Listing; ComponentLink2URL: https://www.digikey.com/product-detail/en/kemet/C0805C104K1RACTU/399-3486-2-ND/754748; TemperatureCoefficient: X7R; Voltage: 100V; Price: 0,0462; Device Package: 0805 (2012 Metric)
J50 J51 = 282834-2: as J23 on sheet TMS; Part Number: 282834-2; PartId: 9289; Supplier 1: Digi-Key; Supplier Part Number 1: A98333-ND; ComponentLink1Description: Datasheet; ComponentLink1URL: http://www.te.com/commerce/DocumentDelivery/DDEController?Action=srchrtrv&DocNm=282834&DocType=Customer+Drawing&DocLang=English; ComponentLink2Description: Digi-Key Listing; ComponentLink2URL: http://www.digikey.ca/product-detail/en/282834-2/A98333-ND/1150135; Price: 1,3; Colour: Green; Orientation: Horizontal with Board
LED1 LED3 = LTST-C170KFKT: as LED10 on sheet TMS; Value: Green; Part Number: LTST-C170KFKT; PartId: 7079; Supplier 1: Digi-Key; Supplier Part Number 1: 160-1413-2-ND; ComponentLink1Description: Datasheet; ComponentLink1URL: http://optoelectronics.liteon.com/upload/download/DS-22-99-0185/S_110_LTST-C170KFKT.pdf; ComponentLink2Description: Digi-Key Listing; ComponentLink2URL: http://www.digikey.ca/product-detail/en/LTST-C170KFKT/160-1413-2-ND/386775; Price: 0,0638; Device Package: 0805 (2012 Metric); Colour: Orange; Lens Transparency: Clear
M1-M4 = 1 Conn
R37 R38 R48-R50 R87 R91 R92 R94 R95 R97-R99 R101-R105 R107 R108 R113 R133-R135 R150 R151 = ERJ-3GEYJ331V: as R19 on sheet TMS; Part Number: ERJ-3GEYJ331V; PartId: 11189; Supplier 1: Digi-Key; Supplier Part Number 1: P330GTR-ND; ComponentLink1Description: Datasheet; ComponentLink1URL: http://industrial.panasonic.com/www-cgi/jvcr13pz.cgi?E+PZ+3+AOA0001+ERJ3GEYJ331V+7+WW; ComponentLink2Description: Digi-Key Listing; ComponentLink2URL: https://www.digikey.com/product-detail/en/panasonic-electronic-components/ERJ-3GEYJ331V/P330GTR-ND/135755; Tolerance: 5%; Price: 0,002; Device Package: 0603 (1608 Metric)
R39 = ERJ-8GEYJ3R3V: RES SMD 3.3 OHM 5% 1/4W 1206; Manufacturer: Panasonic Electronic Components; TemperatureRange: -55C ~ 155C; TemperatureCoefficient: -100/ +600ppm/C; PowerRating: 0.25W, 1/4W; Value: 3.3; Part Number: ERJ-8GEYJ3R3V; PartId: 11912; Supplier 1: Digi-Key; Supplier Part Number 1: P3.3ETR-ND; ComponentLink1Description: Datasheet; ComponentLink1URL: http://industrial.panasonic.com/www-cgi/jvcr13pz.cgi?E+PZ+3+AOA0001+ERJ8GEYJ3R3V+7+WW; ComponentLink2Description: Digi-Key Listing; ComponentLink2URL: https://www.digikey.com/product-detail/en/panasonic-electronic-components/ERJ-8GEYJ3R3V/P3.3ETR-ND/282206; Tolerance: 5%; Price: 0,0045; Device Package: 1206 (3216 Metric)
U8 = TPS736xx: LDO
TP4-TP10 TP15-TP19 TP21 TP22 TP24 TP25 TP27 = Socket: LatestRevisionDate: 17-Jul-2002; LatestRevisionNote: Re-released for DXP Platform.; Publisher: Altium Limited

## Sheet Motor_PowerMosfet.SchDoc
size A4; DrawnBy: Caner ALP; DocumentNumber: 4; SheetNumber: 4; SheetTotal: 4
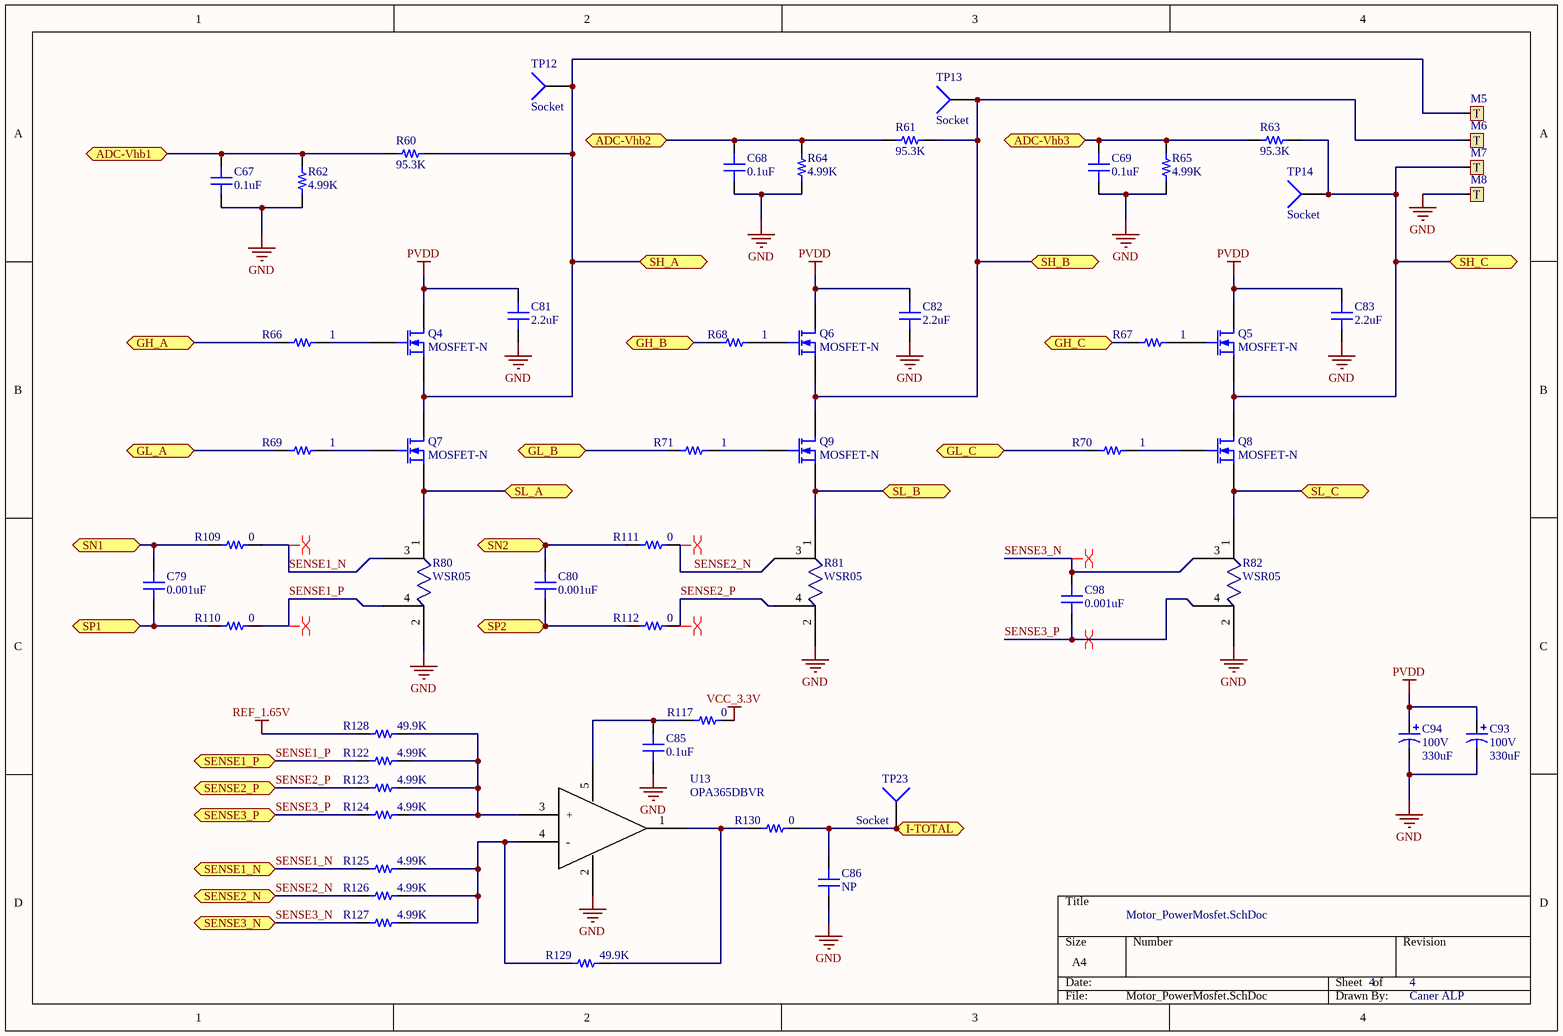
[diagram p3: Motor_PowerMosfet.SchDoc]

### Parts
C67  0.1uF  [CAP 0603/1608]
C68  0.1uF  [CAP 0603/1608]
C69  0.1uF  [CAP 0603/1608]
C79  0.001uF  [CAP 0603/1608]
C80  0.001uF  [CAP 0603/1608]
C81  2.2uF  [CAP 1210/3225 - 2.5MM]
C82  2.2uF  [CAP 1210/3225 - 2.5MM]
C83  2.2uF  [CAP 1210/3225 - 2.5MM]
C85  0.1uF  [CAP 0603/1608]
C86  NP  [CAP 0603/1608]
C93  100V  value 330uF  [RB7.6-15]
C94  100V  value 330uF  [RB7.6-15]
C98  0.001uF  [CAP 0603/1608]
M5  Conn  [M5 Nut]  (value not drawn)
M6  Conn  [M5 Nut]  (value not drawn)
M7  Conn  [M5 Nut]  (value not drawn)
M8  Conn  [M5 Nut]  (value not drawn)
Q4  MOSFET-N  [TO263]
Q5  MOSFET-N  [TO263]
Q6  MOSFET-N  [TO263]
Q7  MOSFET-N  [TO263]
Q8  MOSFET-N  [TO263]
Q9  MOSFET-N  [TO263]
R60  95.3K  [RES 0603/1608]
R61  95.3K  [RES 0603/1608]
R62  4.99K  [RES 0603/1608]
R63  95.3K  [RES 0603/1608]
R64  4.99K  [RES 0603/1608]
R65  4.99K  [RES 0603/1608]
R66  1  [RES 0603/1608]
R67  1  [RES 0603/1608]
R68  1  [RES 0603/1608]
R69  1  [RES 0603/1608]
R70  1  [RES 0603/1608]
R71  1  [RES 0603/1608]
R80  WSR05  [RES]  (net tie, no BOM)
R81  WSR05  [RES]  (net tie, no BOM)
R82  WSR05  [RES]  (net tie, no BOM)
R109  0  [RES 0603/1608]
R110  0  [RES 0603/1608]
R111  0  [RES 0603/1608]
R112  0  [RES 0603/1608]
R117  0  [RES 0603/1608]
R122  4.99K  [RES 0603/1608]
R123  4.99K  [RES 0603/1608]
R124  4.99K  [RES 0603/1608]
R125  4.99K  [RES 0603/1608]
R126  4.99K  [RES 0603/1608]
R127  4.99K  [RES 0603/1608]
R128  49.9K  [RES 0603/1608]
R129  49.9K  [RES 0603/1608]
R130  0  [RES 0603/1608]
TP12  Socket  [PIN1]
TP13  Socket  [PIN1]
TP14  Socket  [PIN1]
TP23  Socket  [PIN1]
U13  OPA365DBVR  [DBV005]

### Ports
ADC-Vhb1, ADC-Vhb2, ADC-Vhb3, GH_A, GH_B, GH_C, GL_A, GL_B, GL_C, I-TOTAL, SENSE1_N, SENSE1_P, SENSE2_N, SENSE2_P, SENSE3_N, SENSE3_P, SH_A, SH_B, SH_C, SL_A, SL_B, SL_C, SN1, SN2, SP1, SP2

### Nets
GND: C67.1 C68.1 C69.1 C81.1 C82.1 C83.1 C85.1 C86.1 C93.2 C94.2 M8.1(T) R62.1 R64.1 R65.1 R80.2 R81.2 R82.2 U13.2
PVDD: C81.2 C82.2 C83.2 C93.1 C94.1 Q4.1(D) Q5.1(D) Q6.1(D)
REF_1.65V: R128.2
VCC_3.3V: R117.1
SENSE1_N: R80.3 R109.1 R125.2 ; port SENSE1_N
SENSE1_P: R80.4 R110.1 R122.2 ; port SENSE1_P
SENSE2_N: R81.3 R111.1 R126.2 ; port SENSE2_N
SENSE2_P: R81.4 R112.1 R123.2 ; port SENSE2_P
SENSE3_N: C98.2 R82.3 R127.2 ; port SENSE3_N
SENSE3_P: C98.1 R82.4 R124.2 ; port SENSE3_P
NetC16_1: M5.1(T) Q4.3(S) Q7.1(D) R60.1 TP12.1 ; port SH_A
NetC17_1: M6.1(T) Q6.3(S) Q9.1(D) R61.1 TP13.1 ; port SH_B
NetC18_1: M7.1(T) Q5.3(S) Q8.1(D) R63.1 TP14.1 ; port SH_C
NetC67_2: C67.2 R60.2 R62.2 ; port ADC-Vhb1
NetC68_2: C68.2 R61.2 R64.2 ; port ADC-Vhb2
NetC69_2: C69.2 R63.2 R65.2 ; port ADC-Vhb3
NetC79_1: C79.1 R110.2 ; port SP1
NetC79_2: C79.2 R109.2 ; port SN1
NetC80_1: C80.1 R112.2 ; port SP2
NetC80_2: C80.2 R111.2 ; port SN2
NetC85_2: C85.2 R117.2 U13.5
NetC86_2: C86.2 R130.1 TP23.1 ; port I-TOTAL
NetQ4_2: Q4.2(G) R66.1
NetQ5_2: Q5.2(G) R67.1
NetQ6_2: Q6.2(G) R68.1
NetQ7_2: Q7.2(G) R69.1
NetQ7_3: Q7.3(S) R80.1 ; port SL_A
NetQ8_2: Q8.2(G) R70.1
NetQ8_3: Q8.3(S) R82.1 ; port SL_C
NetQ9_2: Q9.2(G) R71.1
NetQ9_3: Q9.3(S) R81.1 ; port SL_B
NetR66_2: R66.2 ; port GH_A
NetR67_2: R67.2 ; port GH_C
NetR68_2: R68.2 ; port GH_B
NetR69_2: R69.2 ; port GL_A
NetR70_2: R70.2 ; port GL_C
NetR71_2: R71.2 ; port GL_B
NetR122_1: R122.1 R123.1 R124.1 R128.1 U13.3(+)
NetR125_1: R125.1 R126.1 R127.1 R129.2 U13.4(-)
NetR129_1: R129.1 R130.2 U13.1

### Layout directives
differential pair: SENSE1_N, SENSE1_P, SENSE2_N, SENSE2_P, SENSE3_N, SENSE3_P

### Library data of the parts
C67-C69 C79 C80 C85 C86 C98 = CC0603KPX7R7BB104: as C28 on sheet TMS; Value: 0.1uF; Part Number: CC0603KPX7R7BB104; PartId: 5262; Supplier 1: Digi-Key; Supplier Part Number 1: 311-1335-2-ND; ComponentLink1Description: Datasheet; ComponentLink1URL: http://www.yageo.com/documents/recent/UPY-GPHC_X7R_6.3V-to-50V-v12.pdf; ComponentLink2Description: Digi-Key listing; ComponentLink2URL: http://digikey.com/product-detail/en/CC0603KPX7R7BB104/311-1335-2-ND/2103073; TemperatureCoefficient: X7R; Voltage: 16V; Price: 0,0043; Type: -; Device Package: 0603 (1608 Metric)
C81-C83 = C3225X7R2A225K230AM: as C6 on sheet DRV8301; Value: 2.2uF; Part Number: C3225X7R2A225K230AM; PartId: 18956; Supplier 1: Digi-Key; Supplier Part Number 1: 445-6098-2-ND; ComponentLink1Description: Datasheet; ComponentLink1URL: https://product.tdk.com/info/en/catalog/datasheets/mlcc_commercial_openmode_en.pdf; ComponentLink2Description: Digi-Key Listing; ComponentLink2URL: https://www.digikey.com/product-detail/en/tdk-corporation/C3225X7R2A225K230AM/445-6098-2-ND/2443575; TemperatureCoefficient: X7R; Voltage: 100V; Price: 0,3129; Device Package: 1210 (3225 Metric)
C93 C94 = Cap Pol1: Polarized Capacitor (Radial); Published: 8-Jun-2000; LatestRevisionDate: 17-Jul-2002; LatestRevisionNote: Re-released for DXP Platform.; PackageReference: RB7.6-15; Publisher: Altium Limited; PackageDescription: Polarized Capacitor (Radial); 2 Leads
M5-M8 = 1 Conn
Q4-Q9 = MOSFET-N: N-Channel MOSFET; Published: 8-Jun-2000; LatestRevisionDate: 17-Jul-2002; LatestRevisionNote: Re-released for DXP Platform.; PackageVersion: 1995/1996; PackageReference: E3; Publisher: Altium Limited; PackageDescription: TO, Flat Index; 3 In-Line, Axial Leads; Body Dia. 4.6mm; Lead Dia. 0.5 mm (max)
R60-R71 R109-R112 R117 R122-R130 = ERJ-3GEYJ331V: as R19 on sheet TMS; Part Number: ERJ-3GEYJ331V; PartId: 11189; Supplier 1: Digi-Key; Supplier Part Number 1: P330GTR-ND; ComponentLink1Description: Datasheet; ComponentLink1URL: http://industrial.panasonic.com/www-cgi/jvcr13pz.cgi?E+PZ+3+AOA0001+ERJ3GEYJ331V+7+WW; ComponentLink2Description: Digi-Key Listing; ComponentLink2URL: https://www.digikey.com/product-detail/en/panasonic-electronic-components/ERJ-3GEYJ331V/P330GTR-ND/135755; Tolerance: 5%; Price: 0,002; Device Package: 0603 (1608 Metric)
U13 = TLV2781DBVR
TP12-TP14 TP23 = Socket: LatestRevisionDate: 17-Jul-2002; LatestRevisionNote: Re-released for DXP Platform.; Publisher: Altium Limited

## Nets that join several sheets
GND: TMS (32 pins), DRV8301 (32 pins), Motor_Power (36 pins), Motor_PowerMosfet (18 pins)
PVDD: TMS (R35.1), DRV8301 (8 pins), Motor_Power (7 pins), Motor_PowerMosfet (8 pins)
REF_1.65V: Motor_Power (7 pins), Motor_PowerMosfet (R128.2)
VCC_3.3V: TMS (8 pins), DRV8301 (13 pins), Motor_Power (13 pins), Motor_PowerMosfet (R117.1)
VCC_5V: TMS (C43.2 JP2.2), DRV8301 (6 pins), Motor_Power (C44.2 LED3.1 U8.1 U8.3)
/SCS: TMS (J1.86), DRV8301 (R46.2 R47.1 U1.8)
DC_CAL: TMS (J1.81), DRV8301 (R13.2 U1.12)
EN_GATE: TMS (J1.42), DRV8301 (R12.2 U1.16)
FAULTn: TMS (J1.84), DRV8301 (Q1.1 Q15.1 R9.2 U1.6)
NetC16_1: DRV8301 (C16.1 U1.46), Motor_PowerMosfet (5 pins)
NetC17_1: DRV8301 (C17.1 U1.41), Motor_PowerMosfet (5 pins)
NetC18_1: DRV8301 (C18.1 U1.36), Motor_PowerMosfet (5 pins)
NetC67_2: TMS (J1.21), Motor_PowerMosfet (C67.2 R60.2 R62.2)
NetC68_2: TMS (J1.71), Motor_PowerMosfet (C68.2 R61.2 R64.2)
NetC69_2: TMS (J1.15), Motor_PowerMosfet (C69.2 R63.2 R65.2)
NetC79_1: DRV8301 (U1.32), Motor_PowerMosfet (C79.1 R110.2)
NetC79_2: DRV8301 (U1.33), Motor_PowerMosfet (C79.2 R109.2)
NetC80_1: DRV8301 (U1.30), Motor_PowerMosfet (C80.1 R112.2)
NetC80_2: DRV8301 (U1.31), Motor_PowerMosfet (C80.2 R111.2)
NetC86_2: TMS (J1.61), Motor_PowerMosfet (C86.2 R130.1 TP23.1)
NetC87_2: TMS (J1.9 J1.17), DRV8301 (U1.26), Motor_Power (C87.2 TP15.1 TP16.1)
NetC88_2: TMS (J1.13 J1.59), DRV8301 (U1.25), Motor_Power (C88.2 TP17.1 TP21.1)
NetC95_2: TMS (J1.19), Motor_Power (C95.2 R133.1 TP24.1)
NetC96_2: TMS (J1.69), Motor_Power (C96.2 R134.1 TP25.1)
NetC97_2: TMS (J1.57), Motor_Power (C97.2 R50.2 R135.1 TP19.1)
NetC150_2: TMS (J1.46), Motor_Power (C150.2 J50.1 R150.1)
NetC151_2: TMS (J1.45), Motor_Power (C151.2 J51.1 R151.1)
NetJ1_23: TMS (J1.23), DRV8301 (U1.17)
NetJ1_24: TMS (J1.24), DRV8301 (U1.19)
NetJ1_25: TMS (J1.25), DRV8301 (U1.21)
NetJ1_63: TMS (J1.63 J1.67), Motor_Power (R50.1)
NetJ1_73: TMS (J1.73), DRV8301 (U1.18)
NetJ1_74: TMS (J1.74), DRV8301 (U1.20)
NetJ1_75: TMS (J1.75), DRV8301 (U1.22)
NetJ1_83: TMS (J1.83), DRV8301 (Q2.1 R10.2 U1.5)
NetQ7_3: DRV8301 (U1.44), Motor_PowerMosfet (Q7.3 R80.1)
NetQ8_3: DRV8301 (U1.34), Motor_PowerMosfet (Q8.3 R82.1)
NetQ9_3: DRV8301 (U1.39), Motor_PowerMosfet (Q9.3 R81.1)
NetR66_2: DRV8301 (U1.47), Motor_PowerMosfet (R66.2)
NetR67_2: DRV8301 (U1.37), Motor_PowerMosfet (R67.2)
NetR68_2: DRV8301 (U1.42), Motor_PowerMosfet (R68.2)
NetR69_2: DRV8301 (U1.45), Motor_PowerMosfet (R69.2)
NetR70_2: DRV8301 (U1.35), Motor_PowerMosfet (R70.2)
NetR71_2: DRV8301 (U1.40), Motor_PowerMosfet (R71.2)
SCLK: TMS (J1.36), DRV8301 (R40.2 R41.1 U1.11)
SDI: TMS (J1.35), DRV8301 (R44.2 R45.1 U1.9)
SDO: TMS (J1.85), DRV8301 (R42.2 R43.1 U1.10)
SENSE1_N: Motor_Power (C78.1 R104.2), Motor_PowerMosfet (R80.3 R109.1 R125.2)
SENSE1_P: Motor_Power (C78.2 R101.2), Motor_PowerMosfet (R80.4 R110.1 R122.2)
SENSE2_N: Motor_Power (C75.1 R94.2), Motor_PowerMosfet (R81.3 R111.1 R126.2)
SENSE2_P: Motor_Power (C75.2 R92.2), Motor_PowerMosfet (R81.4 R112.1 R123.2)
SENSE3_N: Motor_Power (C84.1 R102.2), Motor_PowerMosfet (C98.2 R82.3 R127.2)
SENSE3_P: Motor_Power (C84.2 R99.2), Motor_PowerMosfet (C98.1 R82.4 R124.2)